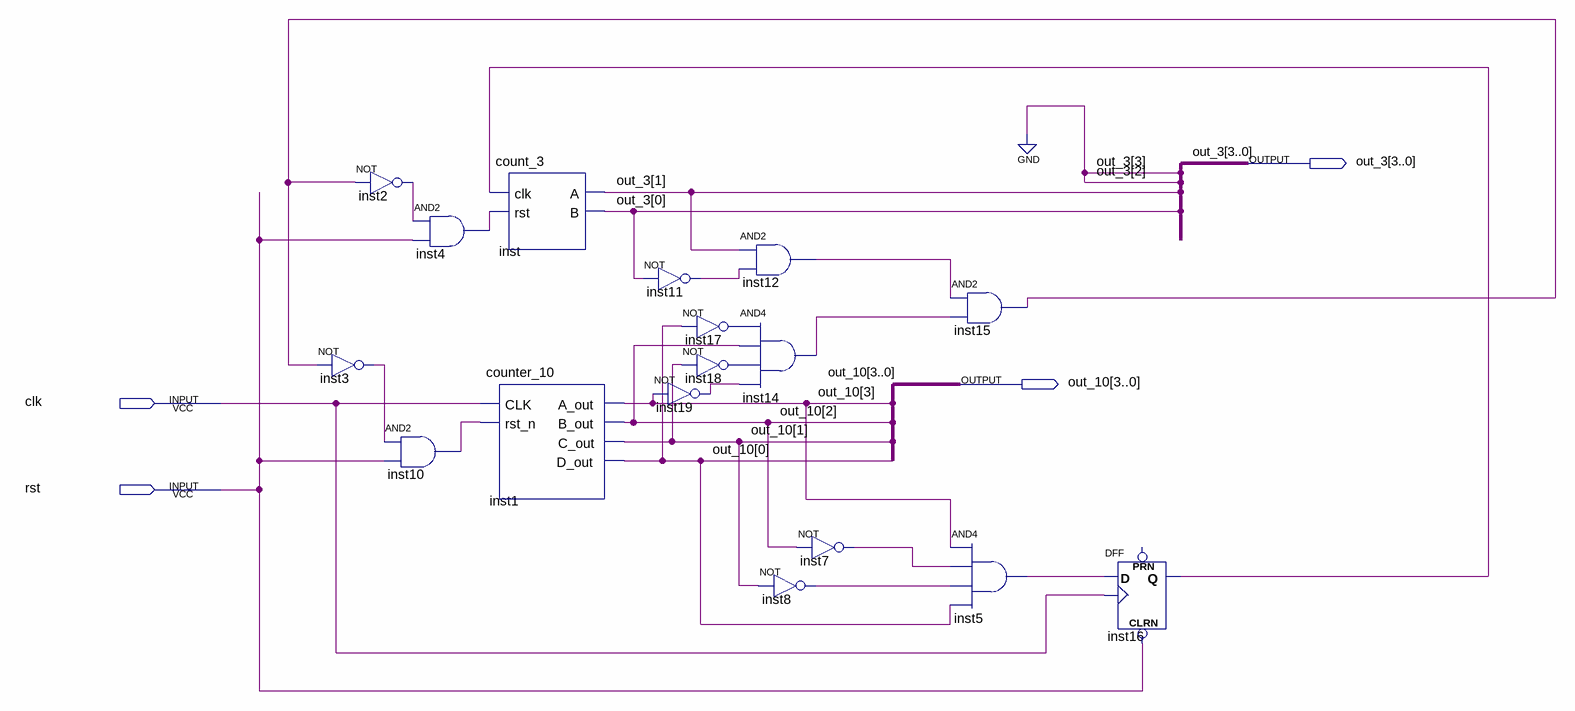
[diagram p0: schematic sheet]
// Quartus schematic count_24.bdf as structural Verilog: 17 symbols, 4 pins
module count_24 (
  input  clk,
  input  rst,
  output [3:0] out_3,
  output [3:0] out_10
);

  wire inst2_out, inst3_out, inst4_out, inst5_out, inst7_out, inst8_out, inst10_out, inst11_out, inst12_out,
       inst14_out, inst15_out, inst16_q, inst17_out, inst18_out, inst19_out;

  not inst3 (inst3_out, inst15_out);
  not inst2 (inst2_out, inst15_out);
  and inst10 (inst10_out, inst3_out, rst);
  and inst4 (inst4_out, inst2_out, rst);
  count_3 inst (.clk(inst16_q), .rst(inst4_out), .A(out_3[1]), .B(out_3[0]));
  counter_10 inst1 (
    .CLK(clk), .rst_n(inst10_out), .A_out(out_10[3]), .B_out(out_10[2]), .C_out(out_10[1]), .D_out(out_10[0]));
  not inst11 (inst11_out, out_3[0]);
  not inst17 (inst17_out, out_10[0]);
  not inst18 (inst18_out, out_10[1]);
  not inst19 (inst19_out, out_10[3]);
  and inst12 (inst12_out, out_3[1], inst11_out);
  and inst14 (inst14_out, inst17_out, out_10[2], inst18_out, inst19_out);
  not inst8 (inst8_out, out_10[1]);
  not inst7 (inst7_out, out_10[2]);
  and inst15 (inst15_out, inst12_out, inst14_out);
  and inst5 (inst5_out, out_10[3], inst7_out, inst8_out, out_10[0]);
  DFF inst16 (.CLRN(rst), .CLK(clk), .D(inst5_out), .Q(inst16_q));  // open: PRN

  assign out_3[3:2] = 2'b00;
endmodule
